# Altium schematic sheet UWBNode_Sch.SchDoc: UWB-Node
size 228 x 177 mm; Author: Hom; CompanyName: KitSprout; DrawnBy: Hom; Engineer: Hom; Organization: KitSprout; Revision: A; SheetNumber: 1; SheetTotal: 1; Version: 1.2; LibVersion: 2.12; PageSetup: Record=PageOptions|CenterHorizontal=True|CenterVertical=True|PrintScale=1.00|XCorrection=1.00|YCorrection=1.00|PrintKind=0|BorderSize=5000000|LeftOffset=0|BottomOffset=0|Orientation=2|PaperLength=1000|PaperWidth=1000|Scale=100|PaperSource=7|PrintQuality=-3|MediaType=1|DitherType=10|PrintScaleMode=0|PaperKind=PostScript 自訂頁面大小¦PaperIndex=32767
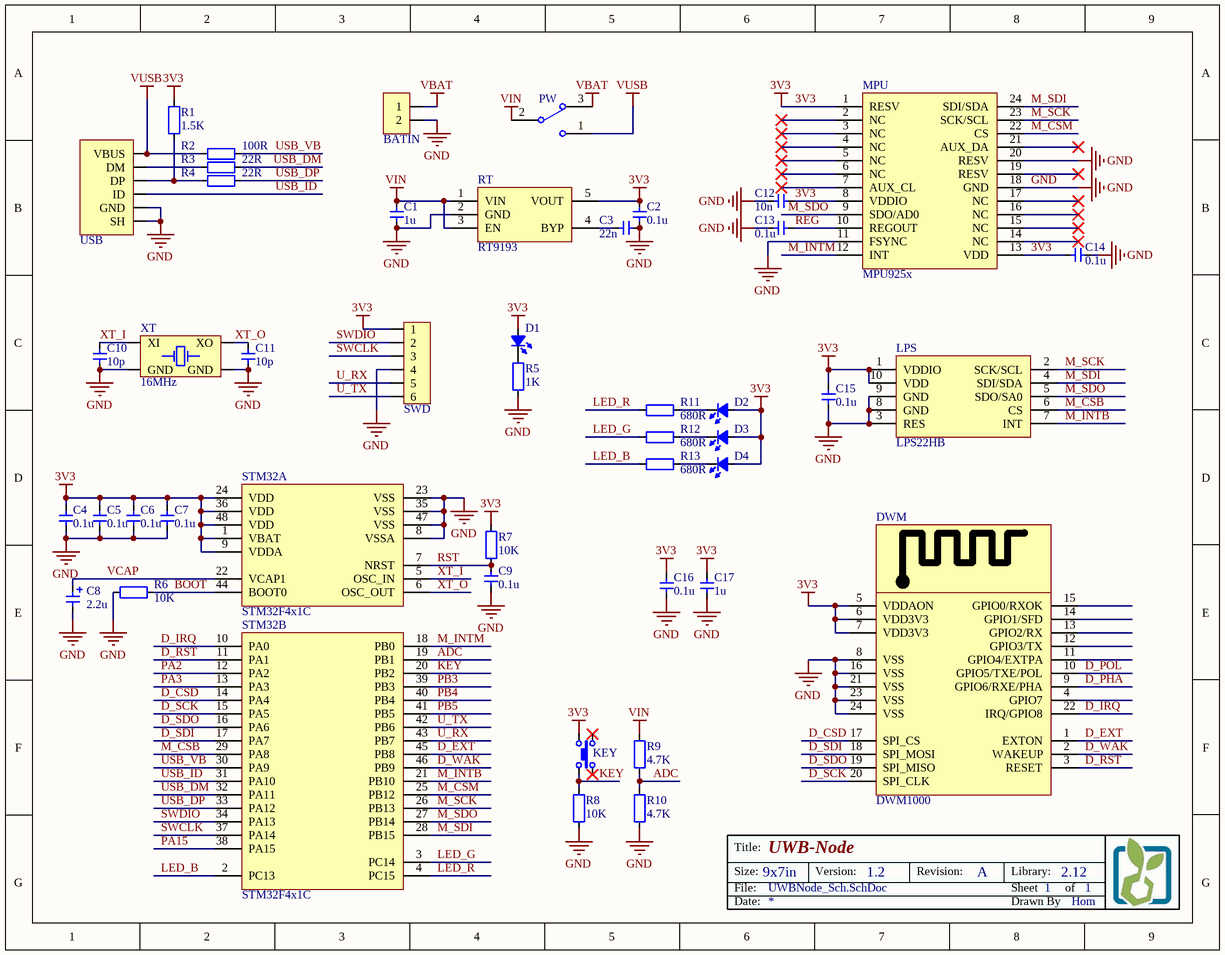
[diagram p0: UWBNode_Sch.SchDoc]

## Parts
BATIN  MX1.25_2P  [MX1.25_S90_2P]  (value not drawn)
C1  value 1u  [CAP_0603]  (hidden comment: Cap_0603)
C2  value 0.1u  [CAP_0603]  (hidden comment: Cap_0603)
C3  value 22n  [CAP_0603]  (hidden comment: Cap_0603)
C4  value 0.1u  [CAP_0603]  (hidden comment: Cap_0603)
C5  value 0.1u  [CAP_0603]  (hidden comment: Cap_0603)
C6  value 0.1u  [CAP_0603]  (hidden comment: Cap_0603)
C7  value 0.1u  [CAP_0603]  (hidden comment: Cap_0603)
C8  value 2.2u  [CAP_TAN_P0805]  (hidden comment: Cap_Tan_0805)
C9  value 0.1u  [CAP_0603]  (hidden comment: Cap_0603)
C10  value 10p  [CAP_0603]  (hidden comment: Cap_0603)
C11  value 10p  [CAP_0603]  (hidden comment: Cap_0603)
C12  value 10n  [CAP_0603]  (hidden comment: Cap_0603)
C13  value 0.1u  [CAP_0603]  (hidden comment: Cap_0603)
C14  value 0.1u  [CAP_0603]  (hidden comment: Cap_0603)
C15  value 0.1u  [CAP_0603]  (hidden comment: Cap_0603)
C16  value 0.1u  [CAP_0603]  (hidden comment: Cap_0603)
C17  value 1u  [CAP_0603]  (hidden comment: Cap_0603)
D1  LED_0603  [LED_0603_YELLOW]  (value not drawn)
D2  LED_0603  [LED_0603_RED]  (value not drawn)
D3  LED_0603  [LED_0603_GREEN]  (value not drawn)
D4  LED_0603  [LED_0603_BLUE]  (value not drawn)
DWM  DWM1000  [DWM1000]
KEY  ButtonTACT  [ButtonTACT_3.5*3.55_90]  (value not drawn)
LPS  LPS22HB  [HCLGA-2x2_10]
MPU  MPU925x  [QFN_P0.4_24]
PW  SwitchSPDT_2.8x6.6_90  [SwitchSPDT_2.8X6.6_90]  (value not drawn)
R1  value 1.5K  [RES_0603]  (hidden comment: Res_0603)
R2  value 100R  [RES_0603]  (hidden comment: Res_0603)
R3  value 22R  [RES_0603]  (hidden comment: Res_0603)
R4  value 22R  [RES_0603]  (hidden comment: Res_0603)
R5  value 1K  [RES_0603]  (hidden comment: Res_0603)
R6  value 10K  [RES_0603]  (hidden comment: Res_0603)
R7  value 10K  [RES_0603]  (hidden comment: Res_0603)
R8  value 10K  [RES_0603]  (hidden comment: Res_0603)
R9  value 4.7K  [RES_0603]  (hidden comment: Res_0603)
R10  value 4.7K  [RES_0603]  (hidden comment: Res_0603)
R11  value 680R  [RES_0603]  (hidden comment: Res_0603)
R12  value 680R  [RES_0603]  (hidden comment: Res_0603)
R13  value 680R  [RES_0603]  (hidden comment: Res_0603)
RT  RT9193  [SOT23-5]
STM32  STM32F4x1C  [QFN_P0.5_48]  (parts A,B of 2)
SWD  HDR1x6_1.27  [HDR1X6_1.27_180HFD]  (value not drawn)
USB  USB_Micro  [USB_Micro-AB]  (value not drawn)
XT  value 16MHz  [XT_2520_4]  (hidden comment: XTAL_2520_4P)

## Nets
3V3: C2.2 C4.1 C5.1 C6.1 C7.1 C12.2 C14.2 C15.1 C16.1 C17.1 D1.1(A) D2.1(A) D3.1(A) D4.1(A) DWM.5(VDDAON) DWM.6(VDD3V3) DWM.7(VDD3V3) KEY.2 LPS.1(VDDIO) LPS.10(VDD) MPU.1(RESV) MPU.8(VDDIO) MPU.13(VDD) R1.1 R7.2 RT.5(VOUT) STM32.1(VBAT) STM32.9(VDDA) STM32.24(VDD) STM32.36(VDD) STM32.48(VDD) SWD.1
GND: BATIN.2 C1.1 C2.1 C3.1 C4.2 C5.2 C6.2 C7.2 C8.2 C9.1 C10.1 C11.1 C12.1 C13.1 C14.1 C15.2 C16.2 C17.2 DWM.8(VSS) DWM.16(VSS) DWM.21(VSS) DWM.23(VSS) DWM.24(VSS) LPS.3(RES) LPS.8(GND) LPS.9(GND) MPU.11(FSYNC) MPU.18(GND) MPU.20(RESV) R5.1 R6.1 R8.1 R10.2 RT.2(GND) STM32.8(VSSA) STM32.23(VSS) STM32.35(VSS) STM32.47(VSS) SWD.4 USB.0(SH) USB.5(GND) XT.2(GND) XT.4(GND)
VBAT: BATIN.1 PW.3
VIN: C1.2 PW.2 R9.1 RT.1(VIN) RT.3(EN)
VUSB: PW.1 R2.2 USB.1(VBUS)
ADC: R9.2 R10.1 STM32.19(PB1)
BOOT: R6.2 STM32.44(BOOT0)
D_CSD: DWM.17(SPI_CS) STM32.14(PA4)
D_EXT: DWM.1(EXTON) STM32.45(PB8)
D_IRQ: DWM.22(IRQ/GPIO8) STM32.10(PA0)
D_PHA: DWM.9(GPIO6/RXE/PHA)
D_POL: DWM.10(GPIO5/TXE/POL)
D_RST: DWM.3(RESET) STM32.11(PA1)
D_SCK: DWM.20(SPI_CLK) STM32.15(PA5)
D_SDI: DWM.18(SPI_MOSI) STM32.17(PA7)
D_SDO: DWM.19(SPI_MISO) STM32.16(PA6)
D_WAK: DWM.2(WAKEUP) STM32.46(PB9)
KEY: KEY.1 R8.2 STM32.20(PB2)
LED_B: R13.2 STM32.2(PC13)
LED_G: R12.2 STM32.3(PC14)
LED_R: R11.2 STM32.4(PC15)
M_CSB: LPS.6(CS) STM32.29(PA8)
M_CSM: MPU.22(CS) STM32.25(PB12)
M_INTB: LPS.7(INT) STM32.21(PB10)
M_INTM: MPU.12(INT) STM32.18(PB0)
M_SCK: LPS.2(SCK/SCL) MPU.23(SCK/SCL) STM32.26(PB13)
M_SDI: LPS.4(SDI/SDA) MPU.24(SDI/SDA) STM32.28(PB15)
M_SDO: LPS.5(SDO/SA0) MPU.9(SDO/AD0) STM32.27(PB14)
PA2: STM32.12(PA2)
PA3: STM32.13(PA3)
PA15: STM32.38(PA15)
PB3: STM32.39(PB3)
PB4: STM32.40(PB4)
PB5: STM32.41(PB5)
REG: C13.2 MPU.10(REGOUT)
RST: C9.2 R7.1 STM32.7(NRST)
SWCLK: STM32.37(PA14) SWD.3
SWDIO: STM32.34(PA13) SWD.2
U_RX: STM32.43(PB7) SWD.5
U_TX: STM32.42(PB6) SWD.6
USB_DM: R3.1 STM32.32(PA11)
USB_DP: R4.1 STM32.33(PA12)
USB_ID: STM32.31(PA10) USB.4(ID)
USB_VB: R2.1 STM32.30(PA9)
VCAP: C8.1 STM32.22(VCAP1)
XT_I: C10.2 STM32.5(OSC_IN) XT.1(XI)
XT_O: C11.2 STM32.6(OSC_OUT) XT.3(XO)
NetC3_2: C3.2 RT.4(BYP)
NetD1_2: D1.2(K) R5.2
NetD2_2: D2.2(K) R11.1
NetD3_2: D3.2(K) R12.1
NetD4_2: D4.2(K) R13.1
NetR1_2: R1.2 R4.2 USB.3(DP)
NetR3_2: R3.2 USB.2(DM)

Not connected (* = marked no-connect by the designer): DWM 4(GPIO7) 11(GPIO4/EXTPA) 12(GPIO3/TX) 13(GPIO2/RX) 14(GPIO1/SFD) 15(GPIO0/RXOK); KEY 3* 4*; MPU 2(NC)* 3(NC)* 4(NC)* 5(NC)* 6(NC)* 7(AUX_CL)* 14(NC)* 15(NC)* 16(NC)* 17(NC)* 19(RESV)* 21(AUX_DA)*

## Notes on the sheet
- Title:
- Size:
- Date:
- File:
- 9x7in
- Version:
- Revision:
- Sheet
- Drawn By
- Library:
- of

## Library data of the parts
BATIN = MX1.25_2P: MX
C1-C7 C9-C17 = Cap_0603: Capacitor
C8 = Cap_Tan_0805: Capacitor
D1-D4 = LED_0603: LED
DWM = DWM1000: Module; Manufacturer: Decawave Limited; Frequency: 3.5GHz ~ 6.5GHz; Data Rate: 6.8Mbps; Serial Interfaces: SPI; Antenna Type: Integrated, Chip; Voltage - Supply: 2.8 V ~ 3.6 V; Current - Receiving: 64mA; Current - Transmitting: 31mA; Supplier 1: Digi-Key; Manufacturer Part Number: DWM1000; RoHS: RoHS Compliant; Category: RF/IF and RFID; Stock 1: 1028; Pricing 1: 1=32.16, 10=26.704, 100=24.24, 250=22.51296 (USD); Packaging: Cut Tape (CT); RF Family/Standard: 802.15.4; Protocol: -; Modulation: -; Power - Output: -; Sensitivity: -; Memory Size: -; Mounting Type: Surface Mount; Operating Temperature: -40°C ~ 85°C; Package / Case: Module; ComponentLink1URL: http://www.decawave.com/sites/default/files/product-pdf/dwm1000-product-brief.pdf; ComponentLink1Description: http://www.decawave.com/sites/default/files/product-pdf/dwm1000-product-brief.pdf; Supplier Part Number 1: 1479-1002-1-ND
KEY = ButtonTACT: Button
LPS = LPS22HB: Sensor Pressure
MPU = MPU925x: Sensor Motion
PW = SwitchSPDT_2.8x6.6_90: Switch
R1-R13 = Res_0603: Resistor
RT = RT9193: Power
STM32 = STM32F4x1C: MCU
SWD = HDR1x6_1.27: Header
USB = USB_Micro: USB
XT = XTAL_2520_4P: Crystal Oscillator